# EAGLE design freeduino-stepper-driver (EAGLE 4.16)
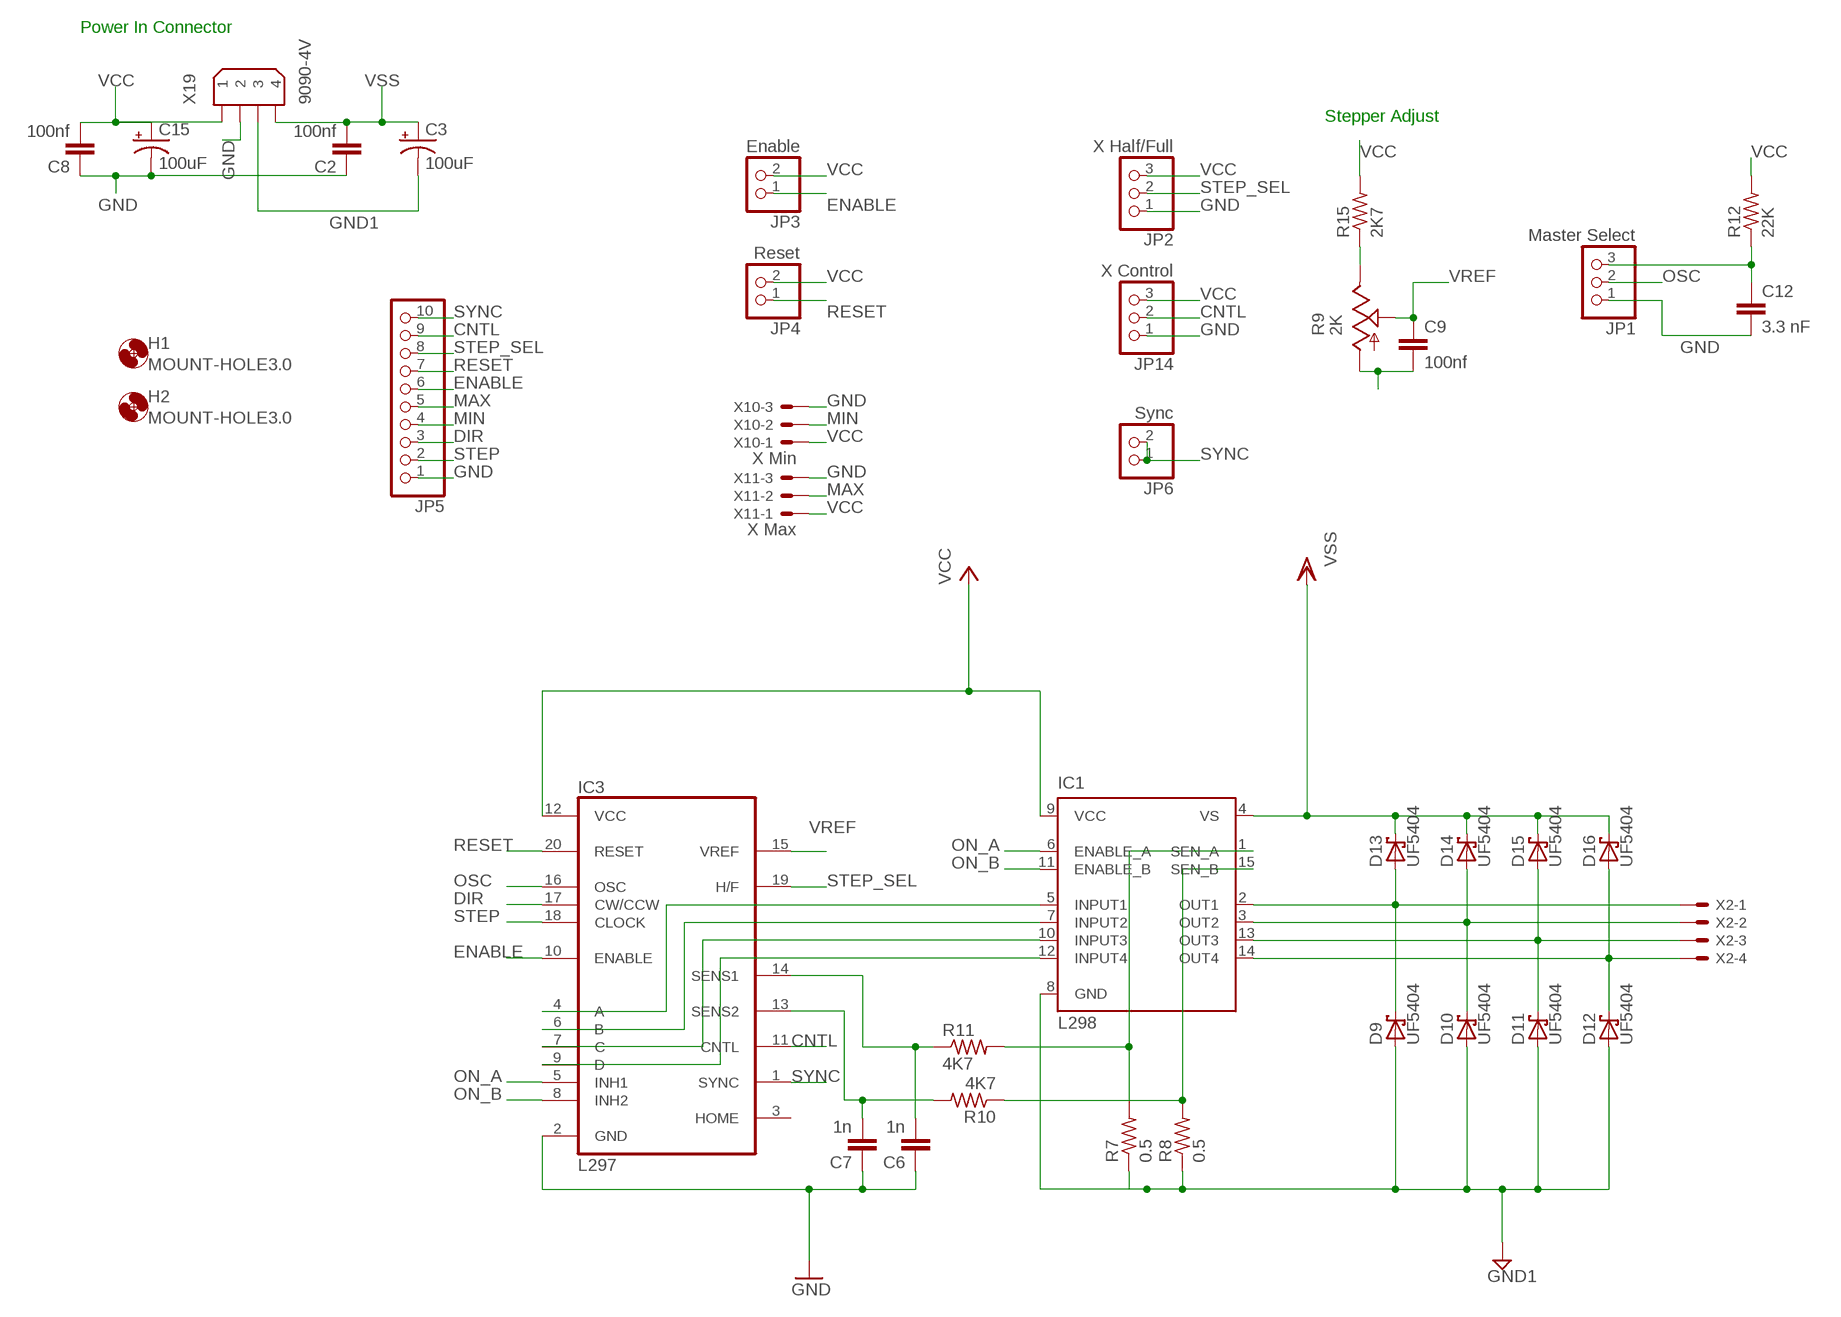
[diagram p0: schematic, sheet 1]

## Parts
C2  100nf  C-EU050-025X075  [C050-025X075]
C3  100uF  CPOL-USE5-6  [E5-6]
C6  1n  C-EU050-030X075  [C050-030X075]
C7  1n  C-EU050-030X075  [C050-030X075]
C8  100nf  C-EU050-025X075  [C050-025X075]
C9  100nf  C-EU050-035X075  [C050-035X075]
C12  3.3 nF  C5/3.5  [C5B3.5]
C15  100uF  CPOL-USE5-6  [E5-6]
D9  UF5404  SCHOTTKY-DIODECB429-15  [CB429-15]
D10  UF5404  SCHOTTKY-DIODECB429-15  [CB429-15]
D11  UF5404  SCHOTTKY-DIODECB429-15  [CB429-15]
D12  UF5404  SCHOTTKY-DIODECB429-15  [CB429-15]
D13  UF5404  SCHOTTKY-DIODECB429-15  [CB429-15]
D14  UF5404  SCHOTTKY-DIODECB429-15  [CB429-15]
D15  UF5404  SCHOTTKY-DIODECB429-15  [CB429-15]
D16  UF5404  SCHOTTKY-DIODECB429-15  [CB429-15]
H1  MOUNT-HOLE3.0  [3,0]
H2  MOUNT-HOLE3.0  [3,0]
IC1  L298  [MULTIWATT-15]
IC3  L297  [DIL20]
JP1  Master Select  PINHD-1X3  [1X03]
JP2  X Half/Full  PINHD-1X3  [1X03]
JP3  Enable  PINHD-1X2  [1X02]
JP4  Reset  PINHD-1X2  [1X02]
JP5  PINHD-1X10  [1X10]
JP6  Sync  PINHD-1X2  [1X02]
JP14  X Control  PINHD-1X3  [1X03]
R7  0.5  R-US_0309/12  [0309/12]
R8  0.5  R-US_0309/12  [0309/12]
R9  2K  TRIM_US-B25U  [B25U]
R10  4K7  R-US_0207/7  [0207/7]
R11  4K7  R-US_0207/7  [0207/7]
R12  22K  R-US_0204/7  [0204/7]
R15  2K7  R-US_0207/7  [0207/7]
X2  KK-156-4  [KK-156-4]
X10  X Min  22-23-2031  [22-23-2031]
X11  X Max  22-23-2031  [22-23-2031]
X19  9090-4V  [9090-4V]

## Nets
CNTL [Power]: IC3.11(CNTL) JP5.9 JP14.2
DIR: IC3.17(CW/CCW) JP5.3
ENABLE: IC3.10(ENABLE) JP3.1 JP5.6
GND [Ground]: C2.1 C6.1 C7.1 C8.1 C9.2 C12.2 C15.- IC3.2(GND) JP1.1 JP2.1 JP5.1 JP14.1 R9.A X10.3 X11.3 X19.2
GND1 [Power]: C3.- D9.A D10.A D11.A D12.A IC1.8(GND) R7.1 R8.1 X19.3
MAX: JP5.5 X11.2
MIN: JP5.4 X10.2
N$1: R9.E R15.1
N$25: IC1.5(INPUT1) IC3.4(A)
N$26: IC1.7(INPUT2) IC3.6(B)
N$27 [Power]: D12.C D16.A IC1.14(OUT4) X2.4
N$28 [Power]: D11.C D15.A IC1.13(OUT3) X2.3
N$29 [Power]: D10.C D14.A IC1.3(OUT2) X2.2
N$30 [Power]: D9.C D13.A IC1.2(OUT1) X2.1
N$31: IC1.10(INPUT3) IC3.7(C)
N$32 [Power]: IC1.15(SEN_B) R8.2 R10.1
N$33 [Power]: IC1.1(SEN_A) R7.2 R11.2
N$34: IC1.12(INPUT4) IC3.9(D)
N$36: C7.2 IC3.13(SENS2) R10.2
N$37: C6.2 IC3.14(SENS1) R11.1
N$41: C12.1 JP1.3 R12.1
ON_A: IC1.6(ENABLE_A) IC3.5(INH1)
ON_B: IC1.11(ENABLE_B) IC3.8(INH2)
OSC: IC3.16(OSC) JP1.2
RESET: IC3.20(RESET) JP4.1 JP5.7
STEP: IC3.18(CLOCK) JP5.2
STEP_SEL: IC3.19(H/F) JP2.2 JP5.8
SYNC: IC3.1(SYNC) JP5.10 JP6.1 JP6.2
VCC: C8.2 C15.+ IC1.9(VCC) IC3.12(VCC) JP2.3 JP3.2 JP4.2 JP14.3 R12.2 R15.2 X10.1 X11.1 X19.1
VREF: C9.1 IC3.15(VREF) R9.S
VSS [Power]: C2.2 C3.+ D13.C D14.C D15.C D16.C IC1.4(VS) X19.4
Unconnected: IC3.3(HOME)

## Notes on the sheet
- Power In Connector
- Stepper Adjust

## Library data of the parts
C2 C6-C9 = rcl:C-EU: CAPACITOR, European symbol
C3 C15 = rcl:CPOL-US: POLARIZED CAPACITOR, American symbol
C12 = capacitor-wima:C: CAPACITOR naming: grid - package width
D9-D16 = diode:SCHOTTKY-DIODE: Schottky Diode
H1 H2 = holes:MOUNT-HOLE: MOUNTING HOLE with drill center marker
IC1 = st-microelectronics:L298: DUAL FULL-BRIDGE DRIVER
IC3 = st-microelectronics:L297: STEPPER MOTOR CONTROLLER
JP1 JP2 JP14 = pinhead:PINHD-1X3: PIN HEADER
JP3 JP4 JP6 = pinhead:PINHD-1X2: PIN HEADER
JP5 = pinhead:PINHD-1X10: PIN HEADER
R7 R8 R10-R12 R15 = rcl:R-US_: RESISTOR, American symbol
R9 = pot:TRIM_US-: POTENTIOMETER
X2 = con-molex:KK-156-4: KK 156 HEADER Source: http://www.molex.com/pdm_docs/sd/026604100_sd.pdf
X10 X11 = con-molex:22-23-2031: .100" (2.54mm) Center Header - 3 Pin
X19 = con-thomas-betts:9090-4: Disk Drive Power four position Source: Thomas & Betts Electronic Interconnects Eiropean Edition 1998

## Net classes
0 default: width 0.406 mm, drill 0.381 mm
1 Power: width 1.27 mm, drill 0.381 mm
2 Signal: width 0.406 mm, drill 0.381 mm
3 Ground: width 0.406 mm, drill 0.381 mm

## Board
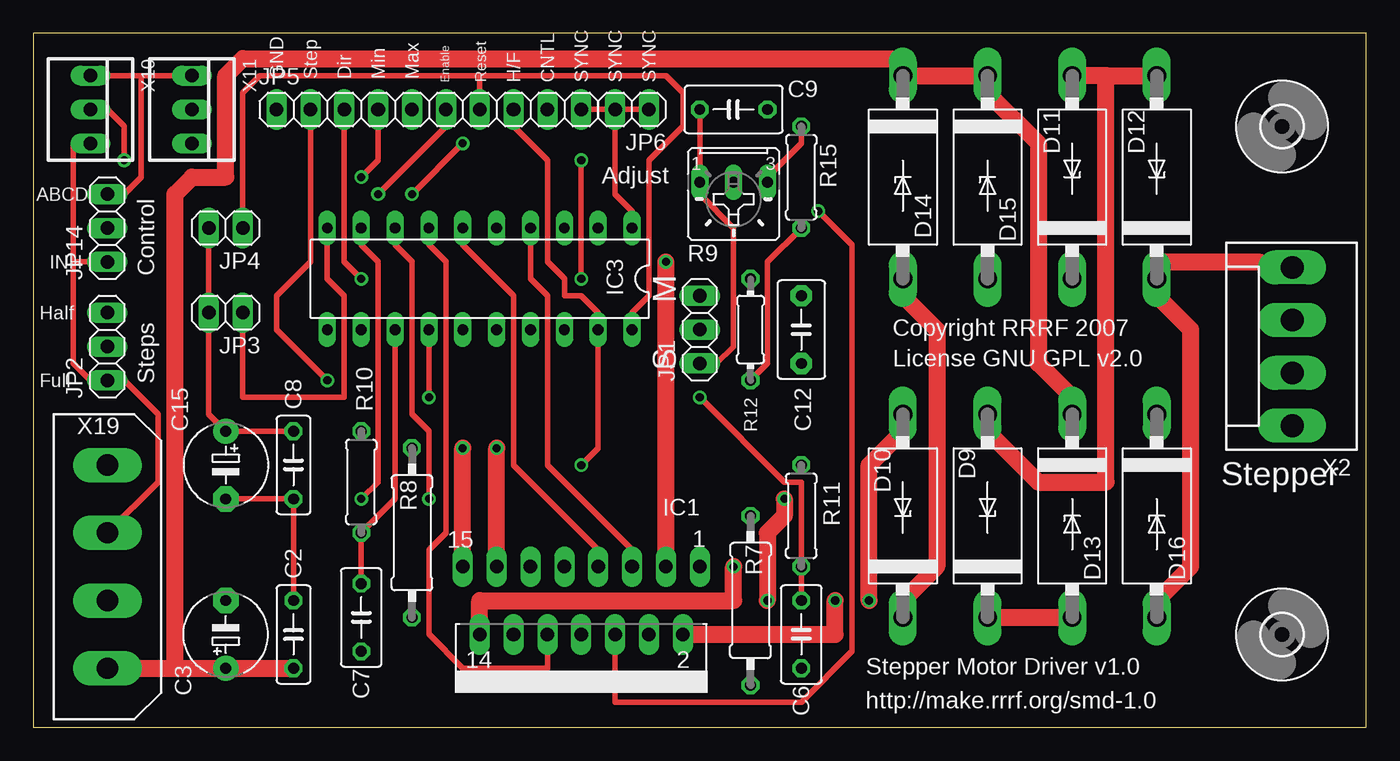
[diagram p1: board, top side]
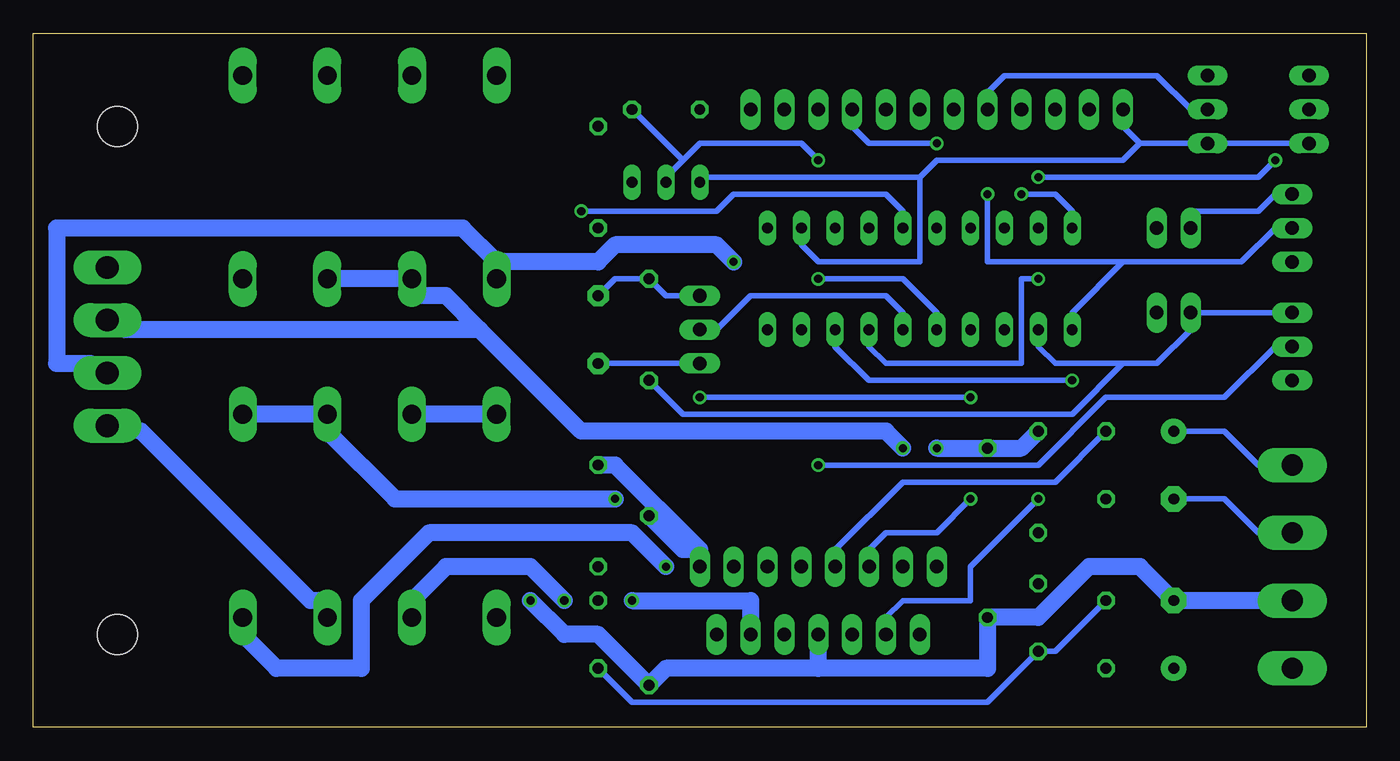
[diagram p2: board, bottom side, seen from below]

Size 100 x 52.06 mm. Coordinates in mm from the lower left corner, seen from the top.
Outline: 0,0 100,0 100,52.06 0,52.06 0,0
Copper layers (1*16): Top 0.035mm / dielectric 1.5mm / Bottom 0.035mm
Design rules "default": minimum track width 10mil, minimum drill 24mil, track to track 8mil, track to pad 8mil, pad to pad 8mil, via to via 8mil, smd to smd 8mil, copper to edge 40mil, drill to drill 8mil, minimum pad ring 10mil, minimum via ring 8mil, stop-mask expansion 4mil, vias tented up to drill 0mil, thermal gap 10mil

### Footprints (pad centres in the part's own frame; a part is rotated, then mirrored left to right if it is on the bottom)
C050-025X075 = drill 0.813 octagon: 1 -2.54,0; 2 2.54,0
E5-6 = drill 0.813 pad 1.905 round: + -2.54,0 | drill 0.813 pad 1.905 octagon: - 2.54,0
C050-030X075 = drill 0.813 octagon: 1 -2.54,0; 2 2.54,0
C050-035X075 = drill 0.813 octagon: 1 -2.54,0; 2 2.54,0
C5B3.5 = drill 0.813 pad 1.6 octagon: 1 -2.54,0; 2 2.54,0
CB429-15 = drill 1.397 long: A 7.62,0; C -7.62,0
3,0 = hole 3: 0,0
MULTIWATT-15 = drill 1.016 long: 1 -8.89,-7.62; 2 -7.62,-2.54; 3 -6.35,-7.62; 4 -5.08,-2.54; 5 -3.81,-7.62; 6 -2.54,-2.54; 7 -1.27,-7.62; 8 0,-2.54; 9 1.27,-7.62; 10 2.54,-2.54; 11 3.81,-7.62; 12 5.08,-2.54; 13 6.35,-7.62; 14 7.62,-2.54; 15 8.89,-7.62
DIL20 = drill 0.813 long: 1 -11.43,-3.81; 2 -8.89,-3.81; 3 -6.35,-3.81; 4 -3.81,-3.81; 5 -1.27,-3.81; 6 1.27,-3.81; 7 3.81,-3.81; 8 6.35,-3.81; 9 8.89,-3.81; 10 11.43,-3.81; 11 11.43,3.81; 12 8.89,3.81; 13 6.35,3.81; 14 3.81,3.81; 15 1.27,3.81; 16 -1.27,3.81; 17 -3.81,3.81; 18 -6.35,3.81; 19 -8.89,3.81; 20 -11.43,3.81
1X03 = drill 1.016 long: 1 -2.54,0; 2 0,0; 3 2.54,0
1X02 = drill 1.016 long: 1 -1.27,0; 2 1.27,0
1X10 = drill 1.016 long: 1 -11.43,0; 2 -8.89,0; 3 -6.35,0; 4 -3.81,0; 5 -1.27,0; 6 1.27,0; 7 3.81,0; 8 6.35,0; 9 8.89,0; 10 11.43,0
0309/12 = drill 0.813 octagon: 1 -6.35,0; 2 6.35,0
B25U = drill 0.813 long: A 2.54,-0.889; E -2.54,-0.889; S 0,-0.889
0207/7 = drill 0.813 octagon: 1 -3.81,0; 2 3.81,0
0204/7 = drill 0.813 octagon: 1 -3.81,0; 2 3.81,0
KK-156-4 = drill 1.7 pad 2.184 long: 1 -5.94,0; 2 -1.98,0; 3 1.98,0; 4 5.94,0
22-23-2031 = drill 1 long: 1 -2.54,0; 2 0,0; 3 2.54,0
9090-4V = drill 1.6 pad 2.6 long: 1 -7.62,0; 2 -2.54,0; 3 2.54,0; 4 7.62,0

### Placement (x,y rotation side)
C2  19.52,6.98 270 top
C3  14.44,6.98 90 top
C6  57.62,6.98 90 top
C7  24.6,8.25 90 top
C8  19.52,19.68 90 top
C9  52.54,46.35 180 top
C12  57.62,29.84 270 top
C15  14.44,19.68 270 top
D9  71.59,15.87 90 top
D10  65.24,15.87 90 top
D11  77.94,41.27 90 top
D12  84.29,41.27 90 top
D13  77.94,15.87 270 top
D14  65.24,41.27 270 top
D15  71.59,41.27 270 top
D16  84.29,15.87 270 top
H1  93.69,6.98 0 top
H2  93.69,45.08 0 top
IC1  41.11,4.44 180 top
IC3  33.49,33.65 180 top
JP1  [1X03]  50,29.84 90 top
JP2  [1X03]  5.55,28.57 90 top
JP3  14.44,31.11 180 top
JP4  14.44,37.46 180 top
JP5  29.68,46.35 0 top
JP6  [1X02]  44.92,46.35 180 top
JP14  [1X03]  5.55,37.46 90 top
R7  53.81,9.52 90 top
R8  28.41,14.6 90 top
R9  52.54,40 180 top
R10  24.6,18.41 270 top
R11  57.62,15.87 90 top
R12  53.81,29.84 270 top
R15  57.62,41.27 270 top
X2  94.45,28.57 90 top
X10  4.28,46.35 270 top
X11  11.9,46.35 270 top
X19  5.55,12.06 270 top

### Tracks (layer width: path | path; a pad name or v marks a point on that pad's centre or on a via)
CNTL  (via drill 0.61)
  Top 0.406: v28.41,40 v32.22,43.81
  Bottom 0.406: 18.25,34.92 22.06,31.11 IC3.11 | 18.25,34.92 9.36,34.92 6.82,37.46 JP14.2 | v32.22,43.81 37.3,43.81 38.57,45.08 JP5.9 | v28.41,40 28.41,34.92 18.25,34.92
DIR  (via drill 0.61)
  Top 0.406: v24.6,33.65 23.33,34.92 JP5.3
  Bottom 0.406: v24.6,33.65 25.87,33.65 25.87,27.3 36.03,27.3 37.3,28.57 IC3.17
ENABLE  (via drill 0.61)
  Top 0.406: IC3.10 22.06,33.65 23.33,32.38 23.33,24.76 15.71,24.76 JP3.1 | v25.87,40 30.95,45.08 JP5.6
  Bottom 0.406: v25.87,40 23.33,40 22.06,38.73 IC3.10
GND
  Top 0.406: C9.2 R9.A 50,40 52.54,37.46 52.54,28.57 51.27,27.3 JP1.1 | 3.01,34.92 3.01,43.81 X10.3 | 3.01,34.92 3.01,27.3 4.28,26.03 JP2.1 6.82,26.03 9.36,23.49 9.36,18.41 X19.2 | 3.01,34.92 JP14.1 | C15.- C8.1 C2.1
  Bottom 0.406: JP1.1 C12.2 | 33.49,41.27 33.49,34.92 41.11,34.92 42.38,36.19 IC3.2 | 33.49,41.27 50,41.27 R9.A | X10.3 X11.3 16.98,43.81 | 16.98,43.81 18.25,45.08 JP5.1 | C15.- 10.63,17.14 8.09,14.6 X19.2 | C6.1 55.08,1.9 28.41,1.9 C7.1 23.33,5.71 C2.1 | 33.49,41.27 32.22,42.54 18.25,42.54 16.98,43.81
GND1  (via drill 0.61)
  Top 1.27: 80.48,48.89 D12.A | 80.48,48.89 D11.A | 80.48,48.89 80.48,18.41 75.4,18.41 71.59,22.22 D9.A | v62.7,9.52 62.7,19.68 65.24,22.22 D10.A
  Bottom 1.27: D10.A D9.A | X19.3 C3.- 16.98,12.06 20.79,12.06 24.6,8.25 R8.1 28.41,4.44 41.11,4.44 | 41.11,4.44 52.54,4.44 R7.1 57.62,6.98 60.16,6.98 v62.7,9.52 | 41.11,4.44 IC1.8
MAX
  Bottom 0.406: X11.2 13.17,46.35 15.71,48.89 27.14,48.89 28.41,47.62 JP5.5
MIN  (via drill 0.61)
  Top 0.406: v6.82,42.54 6.82,45.08 5.55,46.35 X10.2 | v24.6,41.27 25.87,42.54 JP5.4
  Bottom 0.406: v6.82,42.54 8.09,41.27 v24.6,41.27
N$1
  Top 0.406: R15.1 57.62,43.81 55.08,41.27 R9.E
N$25
  Top 0.406: IC3.4 37.3,33.65 38.57,32.38 38.57,19.68 44.92,13.33 IC1.5
N$26
  Top 0.406: IC3.6 32.22,36.19 36.03,32.38 36.03,19.68 42.38,13.33 IC1.7
N$27  (via drill 0.61)
  Top 1.27: X2.4 91.91,34.92 84.29,34.92 D12.C 84.29,32.38 86.83,29.84 86.83,12.06 84.29,9.52 D16.A | v52.54,12.06 52.54,9.52 33.49,9.52 IC1.14
  Bottom 1.27: v52.54,12.06 55.08,14.6 70.32,14.6 75.4,9.52 75.4,4.44 81.75,4.44 84.29,6.98 D16.A
N$28  (via drill 0.61)
  Top 1.27: IC1.13 v34.76,20.95
  Bottom 1.27: v34.76,20.95 36.03,22.22 58.89,22.22 66.51,29.84 | 66.51,29.84 69.05,32.38 71.59,32.38 D15.A D11.C | 66.51,29.84 93.18,29.84 X2.3
N$29  (via drill 0.61)
  Top 1.27: IC1.3 v47.46,34.92 | D10.C 65.24,9.52 67.78,12.06 67.78,29.84 65.24,32.38 D14.A
  Bottom 1.27: v47.46,34.92 48.73,36.19 56.35,36.19 57.62,34.92 65.24,34.92 | 65.24,34.92 67.78,37.46 98.26,37.46 98.26,27.3 95.72,27.3 X2.2 | 65.24,34.92 D14.A
N$30  (via drill 0.61)
  Top 1.27: IC1.2 60.16,6.98 v60.16,9.52 | D9.C D13.A
  Bottom 1.27: v60.16,9.52 62.7,12.06 69.05,12.06 71.59,9.52 D9.C | X2.1 91.91,22.22 79.21,9.52 77.94,9.52 D13.A
N$31
  Top 0.406: IC3.7 29.68,36.19 30.95,34.92 30.95,14.6 29.68,13.33 29.68,6.98 32.22,4.44 38.57,4.44 IC1.10
N$32  (via drill 0.61)
  Top 1.27: IC1.15 v32.22,20.95
  Bottom 1.27: v32.22,20.95 R8.2 25.87,20.95 R10.1
N$33
  Bottom 1.27: R7.2 51.27,13.33 50,13.33 | R11.2 56.35,19.68 50,13.33 | IC1.1 50,13.33
N$34  (via drill 0.61)
  Top 0.406: v24.6,17.14 25.87,18.41 25.87,34.92 24.6,36.19 IC3.9
  Bottom 0.406: v24.6,17.14 29.68,12.06 29.68,9.52 34.76,9.52 36.03,8.25 IC1.12
N$36
  Top 0.406: C7.2 R10.2 27.14,17.14 IC3.13
N$37  (via drill 0.61)
  Top 0.406: C6.2 R11.1 57.62,18.41 56.35,18.41 v50,24.76 | v29.68,24.76 IC3.14
  Bottom 0.406: v29.68,24.76 v50,24.76
N$41
  Bottom 0.406: JP1.3 52.54,32.38 R12.1 56.35,33.65 C12.1
ON_A  (via drill 0.61)
  Top 0.406: v58.89,38.73 61.43,36.19 61.43,5.71 57.62,1.9 43.65,1.9 IC1.6
  Bottom 0.406: v58.89,38.73 48.73,38.73 47.46,40 36.03,40 34.76,38.73 IC3.5
ON_B  (via drill 0.61)
  Top 0.406: v29.68,17.14 29.68,22.22 28.41,23.49 28.41,34.92 27.14,36.19 IC3.8
  Bottom 0.406: v29.68,17.14 32.22,14.6 36.03,14.6 37.3,13.33 IC1.11
OSC
  Bottom 0.406: IC3.16 34.76,31.11 36.03,32.38 46.19,32.38 48.73,29.84 JP1.2
RESET
  Top 0.406: 33.49,48.89 47.46,48.89 48.73,47.62 48.73,45.08 46.19,42.54 46.19,32.38 44.92,31.11 IC3.20 | 33.49,48.89 JP5.7 | 33.49,48.89 16.98,48.89 15.71,47.62 JP4.1
STEP  (via drill 0.61)
  Top 0.406: v22.06,26.03 18.25,29.84 18.25,32.38 20.79,34.92 JP5.2
  Bottom 0.406: v22.06,26.03 37.3,26.03 39.84,28.57 IC3.18
STEP_SEL  (via drill 0.61)
  Top 0.406: JP5.8 36.03,45.08 38.57,42.54 38.57,34.92 39.84,33.65 39.84,32.38 41.11,32.38 42.38,31.11 IC3.19 42.38,20.95 v41.11,19.68
  Bottom 0.406: v41.11,19.68 24.6,19.68 19.52,24.76 10.63,24.76 6.82,28.57 JP2.2
SYNC
  Top 0.406: IC3.1 44.92,38.73 43.65,40 JP6.2 | JP6.2 JP5.10 | JP6.2 JP6.1
VCC
  Top 0.406: C8.2 C15.+ 13.17,23.49 JP3.2 JP4.2 | R12.2 55.08,27.3 55.08,34.92 R15.2 | 8.09,48.89 X10.1 | 8.09,48.89 X11.1 | 8.09,48.89 8.09,41.27 6.82,40 JP14.3
  Bottom 0.406: C8.2 23.33,18.41 34.76,18.41 39.84,13.33 IC1.9 | C15.+ 10.63,22.22 8.09,19.68 X19.1 | 18.25,27.3 15.71,27.3 13.17,29.84 JP3.2 JP2.3 | 18.25,27.3 23.33,27.3 24.6,28.57 IC3.12 | JP14.3 6.82,40 8.09,38.73 13.17,38.73 JP4.2 | R12.2 51.27,23.49 22.06,23.49 18.25,27.3
VREF  (via drill 0.61)
  Top 0.406: v41.11,33.65 v41.11,42.54
  Bottom 0.406: v41.11,33.65 34.76,33.65 32.22,31.11 IC3.15 | v41.11,42.54 42.38,43.81 50,43.81 51.27,42.54 | 51.27,42.54 52.54,41.27 R9.S | 51.27,42.54 C9.1
VSS  (via drill 0.61)
  Top 1.27: C2.2 C3.+ 10.63,4.44 | X19.4 10.63,4.44 | v55.08,9.52 55.08,14.6 56.35,15.87 v56.35,17.14 | D13.C 77.94,24.76 75.4,27.3 75.4,43.81 71.59,47.62 D15.C D14.C 65.24,50.16 15.71,50.16 14.44,48.89 14.44,41.27 11.9,41.27 10.63,40 10.63,4.44
  Bottom 1.27: v55.08,9.52 46.19,9.52 IC1.4 | v56.35,17.14 72.86,17.14 77.94,22.22 D13.C D16.C

### Text on the board
tPlace: GND | Step | Dir | Min | Max | Enable | Reset | H/F | CNTL | SYNC | SYNC | SYNC | Adjust | ABCD | INH | Control | M | Half | Copyright RRRF 2007 | S | License GNU GPL v2.0 | Full | Steps | Stepper | Stepper Motor Driver v1.0 | http://make.rrrf.org/smd-1.0